# EAGLE schematic WirelessPowerRxExtensionBoard (EAGLE 6.4)
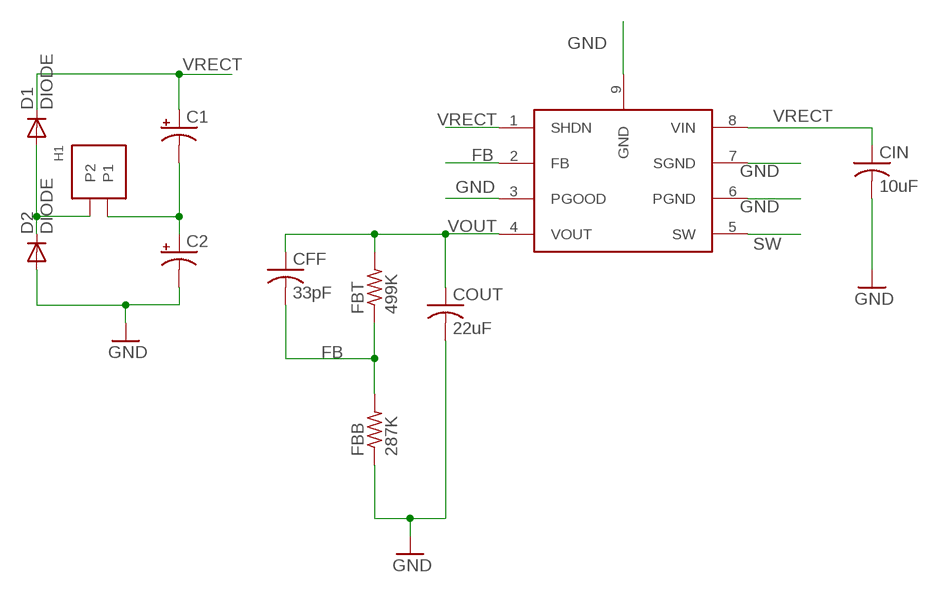
[diagram p0: schematic, sheet 1]

## Parts
C1  CPOL-USE5-13  [E5-13]
C2  CPOL-USE5-13  [E5-13]
CFF  33pF  C-USC0201  [C0201]
CIN  10uF  C-USC0805  [C0805]
COUT  22uF  C-USC0805  [C0805]
D1  DIODE  [DO-214AB]
D2  DIODE  [DO-214AB]
FBB  287K  R-US_M0805  [M0805]
FBT  499K  R-US_M0805  [M0805]
H1  DF3-2  [DF3-2]
U$1  STEPUPCONVERTER  [LTC3528/LTC3528B]

## Nets
FB: CFF.2 FBB.2 FBT.1 U$1.2(FB)
GND: C2.- CIN.2 COUT.2 D2.P$2(A) FBB.1 U$1.3(PGOOD) U$1.6(PGND) U$1.7(SGND) U$1.9(GND)
N$1: D1.P$2(A) D2.P$1(C) H1.P$2(P2)
N$3: C1.- C2.+ H1.P$1(P1)
SW: U$1.5(SW)
VOUT: CFF.1 COUT.1 FBT.2 U$1.4(VOUT)
VRECT: C1.+ CIN.1 D1.P$1(C) U$1.1(SHDN) U$1.8(VIN)

## Library data of the parts
C1 C2 = resistor:CPOL-US: POLARIZED CAPACITOR, American symbol
CFF = rcl:C-US: CAPACITOR, American symbol
CIN COUT = resistor:C-US: CAPACITOR, American symbol
D1 D2 = crawford:DIODE: Diode SSC54-E3/57T SCHOTTKY 5A 40V package DO-214AB
FBB FBT = resistor:R-US_: RESISTOR, American symbol
H1 = hirose:DF3-2
U$1 = crawford:STEPUPCONVERTER: LTC3528/LTC2528B 1A 1MHz Synchronous Step-Up DC/DC Converters in 3mm x 2mm DFN Manufacturer: Linear Technology